# Altium schematic sheet MCP39F511A.SchDoc
size A3
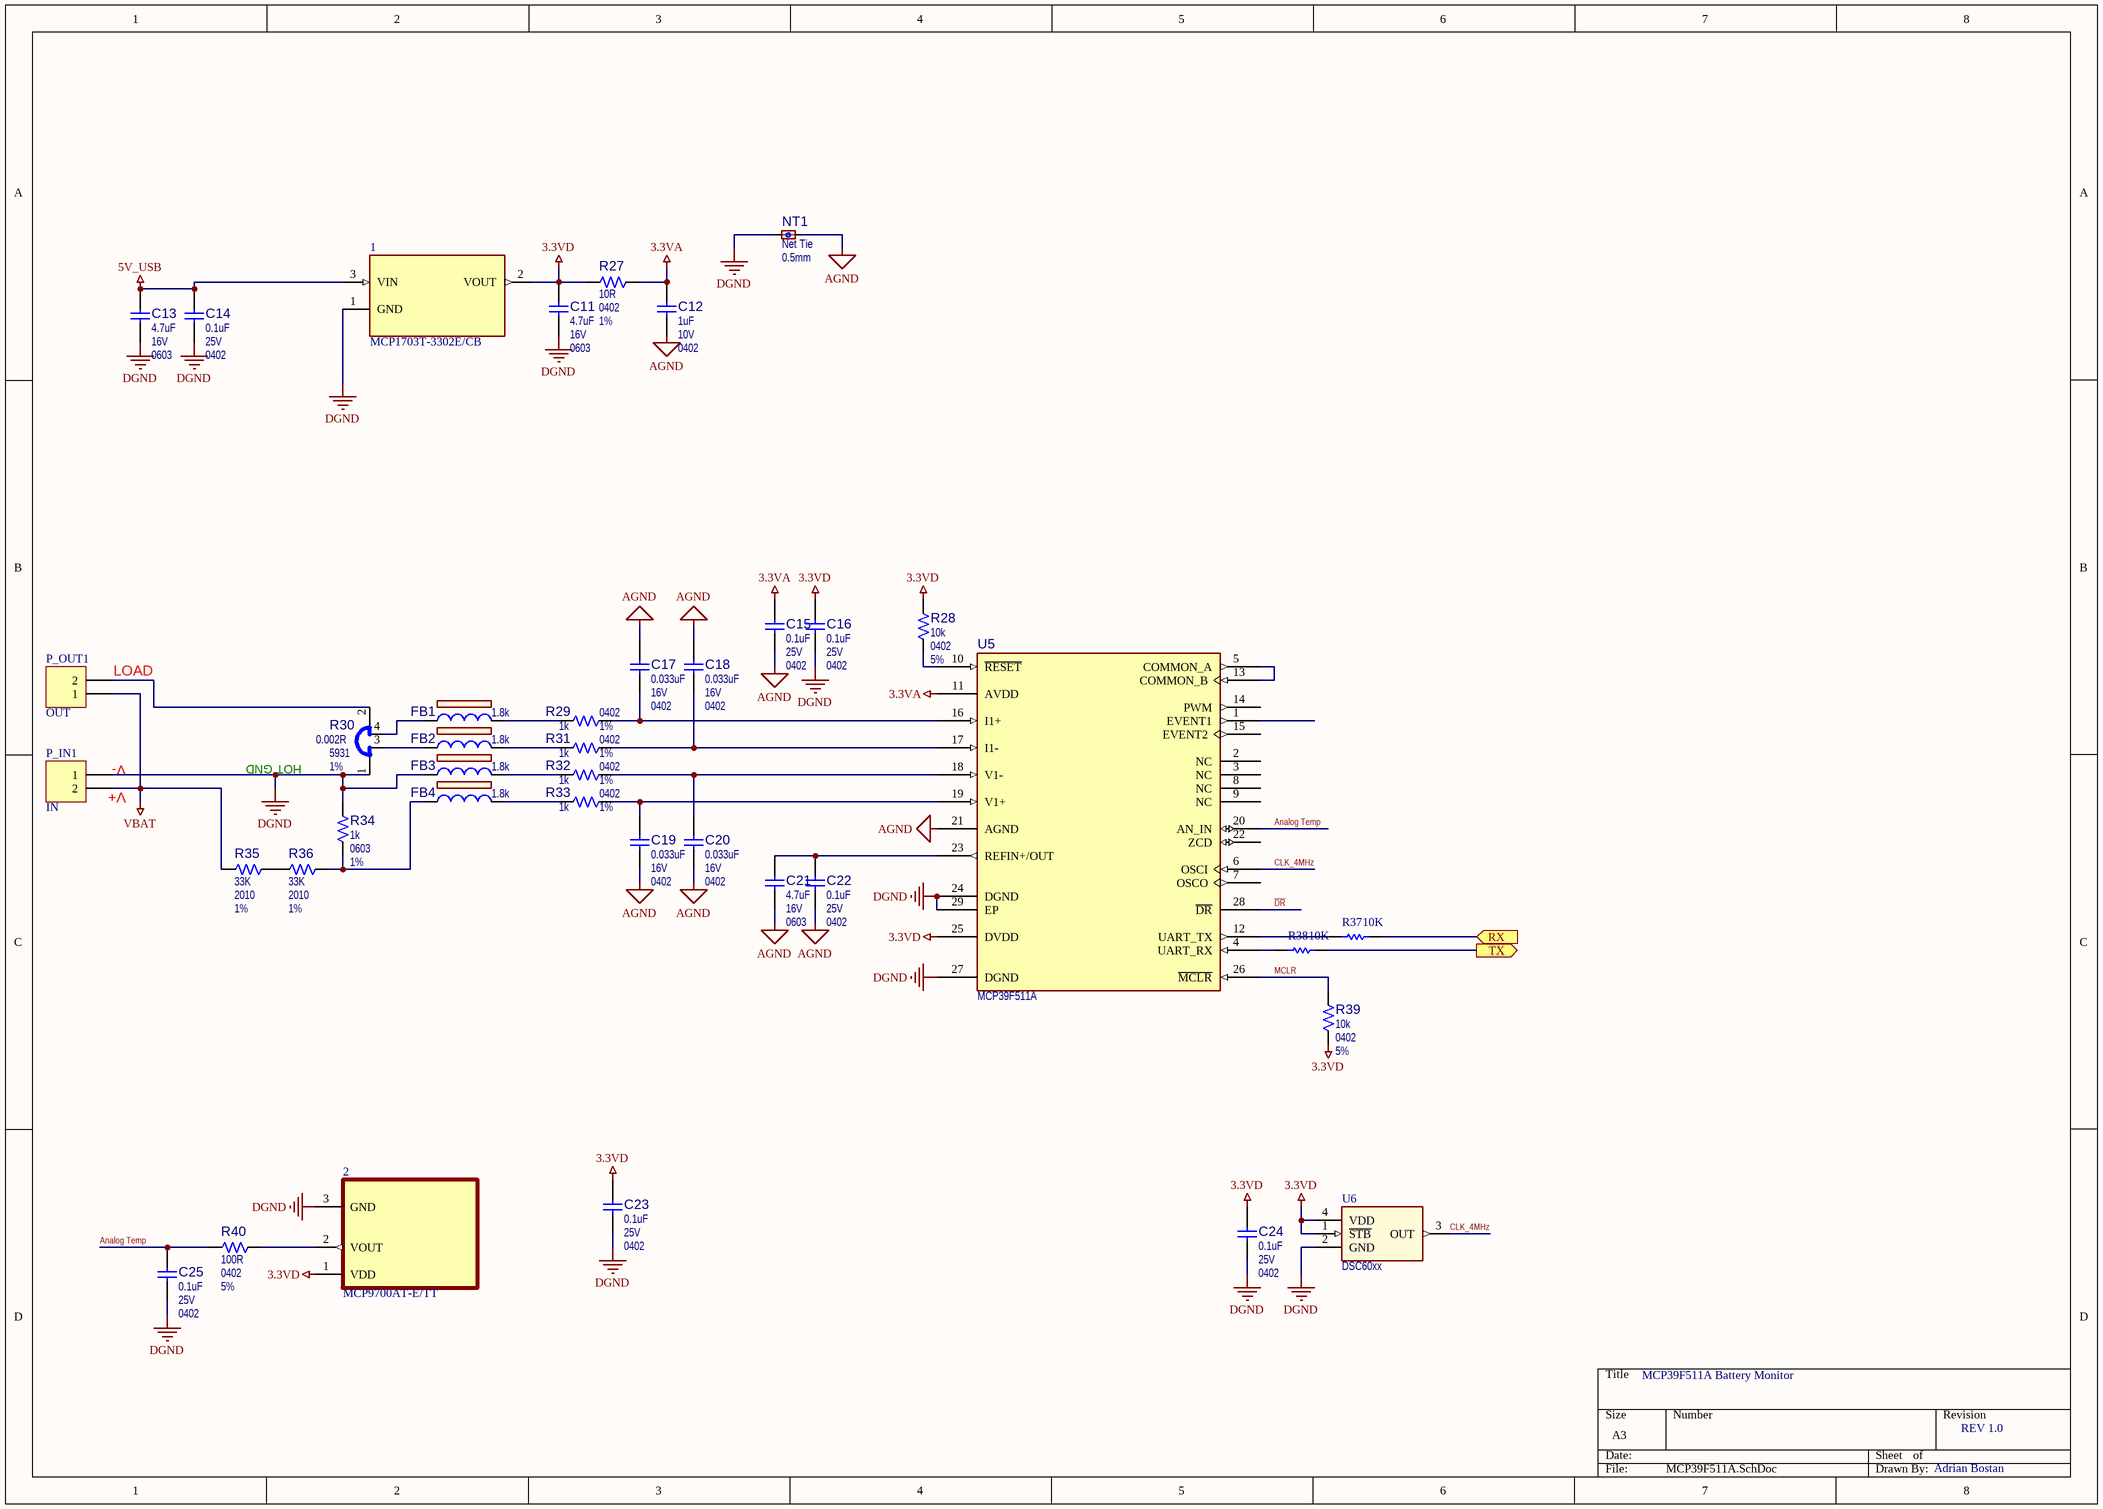
[diagram p0: MCP39F511A.SchDoc]

## Parts
1  MCP1703T-3302E/CB  [SOT95P300X145-3N]
2  MCP9700AT-E/TT  [SOT95P237X112-3N]
C11  value 4.7uF  Voltage: 16V  Package: 0603  [CAP0603M]
C12  value 1uF  Voltage: 10V  Package: 0402  [CAP0603M]
C13  value 4.7uF  Voltage: 16V  Package: 0603  [CAP0603M]
C14  value 0.1uF  Voltage: 25V  Package: 0402  [CAP0603M]
C15  value 0.1uF  Voltage: 25V  Package: 0402  [CAP0603M]
C16  value 0.1uF  Voltage: 25V  Package: 0402  [CAP0603M]
C17  value 0.033uF  Voltage: 16V  Package: 0402  [CAP0603M]
C18  value 0.033uF  Voltage: 16V  Package: 0402  [CAP0603M]
C19  value 0.033uF  Voltage: 16V  Package: 0402  [CAP0603M]
C20  value 0.033uF  Voltage: 16V  Package: 0402  [CAP0603M]
C21  value 4.7uF  Voltage: 16V  Package: 0603  [CAP0603M]
C22  value 0.1uF  Voltage: 25V  Package: 0402  [CAP0603M]
C23  value 0.1uF  Voltage: 25V  Package: 0402  [CAP0603M]
C24  value 0.1uF  Voltage: 25V  Package: 0402  [CAP0603M]
C25  value 0.1uF  Voltage: 25V  Package: 0402  [CAP0603M]
FB1  value 1.8k  [RES0603M]
FB2  value 1.8k  [RES0603M]
FB3  value 1.8k  [RES0603M]
FB4  value 1.8k  [RES0603M]
NT1  Package: 0.5mm  [NET_TIE_0.5mm]  (hidden comment: Net Tie)  (net tie, no BOM)
P_IN1  IN  [XT60PW-M]
P_OUT1  OUT  [XT60PW-F]
R27  value 10R  Package: 0402  Tolerance: 1%  [RES0603M]
R28  value 10k  Package: 0402  Tolerance: 5%  [RES0603M]  (hidden comment: Resistor)
R29  value 1k  Package: 0402  Tolerance: 1%  [RES0603M]  (hidden comment: Resistor)
R30  value 0.002R  Tolerance: 1%  [5931]  (hidden comment: Shunt 4 Pin)
R31  value 1k  Package: 0402  Tolerance: 1%  [RES0603M]  (hidden comment: Resistor)
R32  value 1k  Package: 0402  Tolerance: 1%  [RES0603M]  (hidden comment: Resistor)
R33  value 1k  Package: 0402  Tolerance: 1%  [RES0603M]  (hidden comment: Resistor)
R34  value 1k  Package: 0603  Tolerance: 1%  [RES0603M]  (hidden comment: Resistor)
R35  value 33K  Package: 2010  Tolerance: 1%  [RES2010]  (hidden comment: Resistor)
R36  value 33K  Package: 2010  Tolerance: 1%  [RES2010]  (hidden comment: Resistor)
R37  value 10K  [RES0603M]  (hidden comment: Res1)
R38  value 10K  [RES0603M]  (hidden comment: Res1)
R39  value 10k  Package: 0402  Tolerance: 5%  [RES0603M]  (hidden comment: Resistor)
R40  value 100R  Package: 0402  Tolerance: 5%  [RES0603M]  (hidden comment: Resistor)
U5  value MCP39F511A  [QFN50P500X500X100-29N]  (hidden comment: MCP39F511 QFN-28)
U6  value DSC60xx  [DSC60xx]  (hidden comment: OSCILLATOR DSC1001)

## Ports
RX (in), TX (out)

## Nets
3.3VA: C12.2 C15.2 R27.2 U5.11(AVDD)
3.3VD: 1.2(VOUT) 2.1(VDD) C11.2 C16.2 C23.2 C24.2 R27.1 R28.2 R39.1 U5.25(DVDD) U6.1(~{STB}) U6.4(VDD)
5V_USB: 1.3(VIN) C13.1 C14.2
AGND: C12.1 C15.1 C17.2 C18.2 C19.1 C20.1 C21.1 C22.1 NT1.2 U5.21(AGND)
DGND: 1.1(GND) 2.3(GND) C11.1 C13.2 C14.1 C16.1 C23.1 C24.1 C25.1 FB3.1 NT1.1 P_IN1.1 R30.1 R34.2 U5.24(DGND) U5.27(DGND) U5.29(EP) U6.2(GND)
VBAT: P_IN1.2 P_OUT1.1 R35.1
Analog Temp: C25.2 R40.1 U5.20(AN_IN)
CLK_4MHz: U5.6(OSCI) U6.3(OUT)
~{DR}: U5.28(~{DR})
MCLR: R39.2 U5.26(~{MCLR})
RX: R37.1 ; port RX
TX: R38.1 ; port TX
Net2_2: 2.2(VOUT) R40.2
NetC17_1: C17.1 R29.2 U5.16(I1+)
NetC18_1: C18.1 R31.2 U5.17(I1-)
NetC19_2: C19.2 R33.2 U5.19(V1+)
NetC20_2: C20.2 R32.2 U5.18(V1-)
NetC21_2: C21.2 C22.2 U5.23(REFIN+/OUT)
NetFB1_1: FB1.1 R30.4
NetFB1_2: FB1.2 R29.1
NetFB2_1: FB2.1 R30.3
NetFB2_2: FB2.2 R31.1
NetFB3_2: FB3.2 R32.1
NetFB4_1: FB4.1 R34.1 R36.1
NetFB4_2: FB4.2 R33.1
NetP_OUT1_2: P_OUT1.2 R30.2
NetR28_1: R28.1 U5.10(~{RESET})
NetR35_2: R35.2 R36.2
NetR37_2: R37.2 U5.12(UART_TX)
NetR38_2: R38.2 U5.4(UART_RX)
NetU5_5: U5.5(COMMON_A) U5.13(COMMON_B)

Not connected (* = marked no-connect by the designer): U5 1(EVENT1) 2(NC) 3(NC) 7(OSCO) 8(NC) 9(NC) 14(PWM) 15(EVENT2) 22(ZCD)

## Notes on the sheet
- (near P_OUT1) LOAD
- (near P_IN1) V+
- (near P_IN1) V-
- HOT GND
- MCP39F511A Battery Monitor
- REV 1.0
- Adrian Bostan

## Library data of the parts
1 = MCP1703T-3302E/CB: Linear Voltage Regulator IC 1 Output 250mA SOT-23A-3; MF: Microchip; Price: None; Availability: Unavailable; MP: MCP1703T-3302E/CB; Package: SOT-23 Microchip; SnapEDA_Link: https://www.snapeda.com/parts/MCP1703T-3302E/CB/Microchip/view-part/47542/?ref=snap; Value: *
2 = MCP9700AT-E/TT: Temperature Sensor Analog, Local -40Â°C ~ 125Â°C 10mV/Â°C SOT-23-3; MF: Microchip; Package: SOT-23-3 Microchip; MP: MCP9700AT-E/TT; Value: *; Availability: Unavailable; Price: None; SnapEDA_Link: https://www.snapeda.com/parts/MCP9700AT-E/TT/Microchip/view-part/105359/?ref=snap
C11 C21 = CAP1288: Capacitor; Manufacturer 1: TDK Corporation; Manufacturer Part Number 1: C1608X5R1C475K080AC; Description_: CAP CER 4.7uF 16V 10% X5R SMD 0603; Dev Tools Status: Production; Tolerance: 10%; Temperature Coeffcient: X5R; Type: Ceramic; Owner: Jairuz Agang-ang; Populated: YES; MCHP-ID: CAP1288; Revision: 1; Symbol: Capacitor NP; Status: MCL Design; ComponentLink1URL: https://chn-vm-apps.microchip.com/mchprepo/parts/Datasheets/mlcc_commercial_general_en.pdf; ComponentLink1Description: SVN Datasheet; ComponentLink2URL: C:\ALTIUM_WORK\00001_MCHP-CDB\Datasheets\mlcc_commercial_general_en.pdf; ComponentLink2Description: Local Datasheet; ComponentLink3URL: C:\ALTIUM_WORK\00001_MCHP-CDB\Library\LibraryRefs\Capacitor NP.SchLib; ComponentLink3Description: Open Symbol; ComponentLink4URL: C:\ALTIUM_WORK\00001_MCHP-CDB\Library\Footprints\CAP_C_0603.PcbLib; ComponentLink4Description: Open Footprint; ComponentLink5Description: Open Footprint 2; ComponentLink6Description: Open Footprint 3; ComponentLink7Description: Open Footprint 4; Operating Temperature: -55C to +85C; Category: Capacitor; Supplier 1: Digi-Key; Supplier Part Number 1: 445-7478-1-ND; Quantity Override: 1
C12 = CAP1183: Capacitor; Manufacturer 1: Murata Electronics North America; Manufacturer Part Number 1: GRM155R61A105KE15D; Description_: CAP CER 1uF 10V 10% X5R SMD 0402; Dev Tools Status: Production; Tolerance: 10%; Temperature Coeffcient: X5R; Type: Ceramic; Owner: Aaron VanDuerm; Populated: YES; MCHP-ID: CAP1183; Revision: 0; Symbol: Capacitor NP; Status: MCL Design; ComponentLink1URL: https://chn-vm-apps.microchip.com/mchprepo/parts/Datasheets/CL05A105KP5NNNC1.pdf; ComponentLink1Description: SVN Datasheet; ComponentLink2URL: C:\ALTIUM_WORK\00001_MCHP-CDB\Datasheets\CL05A105KP5NNNC1.pdf; ComponentLink2Description: Local Datasheet; ComponentLink3URL: C:\ALTIUM_WORK\00001_MCHP-CDB\Library\LibraryRefs\Capacitor NP.SchLib; ComponentLink3Description: Open Symbol; ComponentLink4URL: C:\ALTIUM_WORK\00001_MCHP-CDB\Library\Footprints\CAP_C_0402.PcbLib; ComponentLink4Description: Open Footprint; ComponentLink5Description: Open Footprint 2; ComponentLink6Description: Open Footprint 3; ComponentLink7Description: Open Footprint 4; Operating Temperature: -55C to +85C; Category: Capacitor; Supplier 1: Digi-Key; Supplier Part Number 1: 490-3890-1-ND; Quantity Override: 1; Manufacturer 2: Samsung; Manufacturer Part Number 2: CL05A105KP5NNNC; Supplier 2: Digi-Key; Supplier Part Number 2: 1276-1076-2-ND
C13 = CAP1288: Capacitor; Manufacturer 1: TDK Corporation; Manufacturer Part Number 1: C1608X5R1C475K080AC; Description_: CAP CER 4.7uF 16V 10% X5R SMD 0603; Dev Tools Status: Production; Tolerance: 10%; Temperature Coeffcient: X5R; Type: Ceramic; Populated: YES; Owner: Jairuz Agang-ang; MCHP-ID: CAP1288; Revision: 1; Symbol: Capacitor NP; Status: MCL Design; ComponentLink1URL: https://chn-vm-apps.microchip.com/mchprepo/parts/Datasheets/mlcc_commercial_general_en.pdf; ComponentLink1Description: SVN Datasheet; ComponentLink2URL: C:\ALTIUM_WORK\00001_MCHP-CDB\Datasheets\mlcc_commercial_general_en.pdf; ComponentLink2Description: Local Datasheet; ComponentLink3URL: C:\ALTIUM_WORK\00001_MCHP-CDB\Library\LibraryRefs\Capacitor NP.SchLib; ComponentLink3Description: Open Symbol; ComponentLink4URL: C:\ALTIUM_WORK\00001_MCHP-CDB\Library\Footprints\CAP_C_0603.PcbLib; ComponentLink4Description: Open Footprint; ComponentLink5Description: Open Footprint 2; ComponentLink6Description: Open Footprint 3; ComponentLink7Description: Open Footprint 4; Operating Temperature: -55C to +85C; Category: Capacitor; Supplier 1: Digi-Key; Supplier Part Number 1: 445-7478-1-ND; Quantity Override: 1
C14-C16 C22-C25 = CAP1345: Capacitor; Manufacturer 1: TDK Corporation; Manufacturer Part Number 1: C1005X7R1E104K050BB; Description_: CAP CER 0.1uF 25V 10% X7R SMD 0402; Dev Tools Status: Production; Tolerance: 10%; Temperature Coeffcient: X7R; Type: Ceramic; Owner: Randolph Sobrepena; Populated: YES; MCHP-ID: CAP1345; Revision: 1; Symbol: Capacitor NP; Status: MCL Design; ComponentLink1URL: https://chn-vm-apps.microchip.com/mchprepo/parts/Datasheets/mlcc_commercial_general_en; ComponentLink1Description: SVN Datasheet; ComponentLink2URL: C:\ALTIUM_WORK\00001_MCHP-CDB\Datasheets\mlcc_commercial_general_en; ComponentLink2Description: Local Datasheet; ComponentLink3URL: C:\ALTIUM_WORK\00001_MCHP-CDB\Library\LibraryRefs\Capacitor NP.SchLib; ComponentLink3Description: Open Symbol; ComponentLink4URL: C:\ALTIUM_WORK\00001_MCHP-CDB\Library\Footprints\CAP_C_0402.PcbLib; ComponentLink4Description: Open Footprint; ComponentLink5Description: Open Footprint 2; ComponentLink6Description: Open Footprint 3; ComponentLink7Description: Open Footprint 4; Operating Temperature: -55°C to 125°C; Category: Capacitor; Supplier 1: Digi-Key; Supplier Part Number 1: 445-7348-1-ND; Quantity Override: 1
C17-C20 = CAP1257: Capacitor; Manufacturer 1: TDK Corporation; Manufacturer Part Number 1: CGA2B2X7R1C333K050BA; Description_: CAP CER 0.033uF 16V 10% X7R SMD 0402; Dev Tools Status: Design; Tolerance: 10%; Temperature Coeffcient: X7R; Type: Ceramic; Owner: Bogdan Popescu; Populated: YES; MCHP-ID: CAP1257; Revision: A; Symbol: Capacitor NP; Status: MCL Design; ComponentLink1URL: https://chn-vm-apps.microchip.com/mchprepo/parts/Datasheets/mlcc_automotive_general_en.pdf; ComponentLink1Description: SVN Datasheet; ComponentLink2URL: C:\ALTIUM_WORK\00001_MCHP-CDB\Datasheets\mlcc_automotive_general_en.pdf; ComponentLink2Description: Local Datasheet; ComponentLink3URL: C:\ALTIUM_WORK\00001_MCHP-CDB\Library\LibraryRefs\Capacitor NP.SchLib; ComponentLink3Description: Open Symbol; ComponentLink4URL: C:\ALTIUM_WORK\00001_MCHP-CDB\Library\Footprints\CAP_C_0402.PcbLib; ComponentLink4Description: Open Footprint; ComponentLink5Description: Open Footprint 2; ComponentLink6Description: Open Footprint 3; ComponentLink7Description: Open Footprint 4; Operating Temperature: -55C to +125C; Category: Capacitor; Supplier 1: Digi-Key; Supplier Part Number 1: 445-12238-1-ND; Quantity Override: 1
FB1-FB4 = IND1351: Manufacturer 1: Murata Electronics; Manufacturer Part Number 1: BLM15HD182SN1D; Description_: FERRITE 1.8k 200mA SMD 0402; Dev Tools Status: Design; Owner: Razvan Cristescu; Populated: YES; DCR: 2.2R; Saturation Current: 200mA; Test Frequency: 100MHz; MCHP-ID: IND1351; Revision: A; Symbol: Ferrite Bead; Status: MCL Design; ComponentLink1URL: https://chn-vm-apps.microchip.com/mchprepo/parts/Datasheets/c31e-794748.pdf; ComponentLink1Description: SVN Datasheet; ComponentLink2URL: C:\ALTIUM_WORK\00001_MCHP-CDB\Datasheets\c31e-794748.pdf; ComponentLink2Description: Local Datasheet; ComponentLink3URL: C:\ALTIUM_WORK\00001_MCHP-CDB\Library\LibraryRefs\Ferrite Bead.SchLib; ComponentLink3Description: Open Symbol; ComponentLink4URL: C:\ALTIUM_WORK\00001_MCHP-CDB\Library\LibraryRefs\IND_C_0402.PcbLib; ComponentLink4Description: Open Footprint; ComponentLink5Description: Open Footprint 2; ComponentLink6Description: Open Footprint 3; ComponentLink7Description: Open Footprint 4; Type: Ferrite Bead; Category: Inductor; Supplier 1: Mouser; Supplier Part Number 1: 81-BLM15HD182SN1D; Quantity Override: 1; Operating Temperature: -55C to +125C; Package: 0402
NT1 = RES1102: Description_: RES Net Tie SMD Net Tie 0.5mm; Dev Tools Status: Production; Owner: Bogdan P (M91398); Populated: Yes; MCHP-ID: RES1102; Value: Net Tie; Revision: 0; Symbol: Net Tie; Status: MCL Design; ComponentLink1Description: SVN Datasheet; ComponentLink2Description: Local Datasheet; ComponentLink3URL: C:\ALTIUM_WORK\00001_MCHP-CDB\Library\LibraryRefs\Net Tie.SchLib; ComponentLink3Description: Open Symbol; ComponentLink4URL: C:\ALTIUM_WORK\00001_MCHP-CDB\Library\Footprints\NET_TIE_0.5mm.PcbLib; ComponentLink4Description: Open Footprint; ComponentLink5Description: Open Footprint 2; ComponentLink6Description: Open Footprint 3; ComponentLink7Description: Open Footprint 4; Category: Resistor; Type: RES SMD; Quantity Override: 1
P_IN1 P_OUT1 = Header 2: Header, 2-Pin; LatestRevisionDate: 17-Jul-2002; LatestRevisionNote: Re-released for DXP Platform.; Publisher: Altium Limited
R27 = RES1305: Resistor; Manufacturer 1: ROHM; Manufacturer Part Number 1: MCR01MRTF10R0; Description_: RES TKF 10R 1% 1/16W SMD 0402; Dev Tools Status: Production; Voltage: 50V; Temperature Coeffcient: 100ppm/C; Power: 1/16W; Owner: Tad Ahlvers; Populated: YES; MCHP-ID: RES1305; Revision: 1; Symbol: Resistor; Status: MCL Design; ComponentLink1URL: https://chn-vm-apps.microchip.com/mchprepo/parts/Datasheets/mcr_g.pdf; ComponentLink1Description: SVN Datasheet; ComponentLink2URL: C:\ALTIUM_WORK\00001_MCHP-CDB\Datasheets\mcr_g.pdf; ComponentLink2Description: Local Datasheet; ComponentLink3URL: C:\ALTIUM_WORK\00001_MCHP-CDB\Library\LibraryRefs\Resistor.SchLib; ComponentLink3Description: Open Symbol; ComponentLink4URL: C:\ALTIUM_WORK\00001_MCHP-CDB\Library\Footprints\RES_C_0402.PcbLib; ComponentLink4Description: Open Footprint; ComponentLink5Description: Open Footprint 2; ComponentLink6Description: Open Footprint 3; ComponentLink7Description: Open Footprint 4; Operating Temperature: -55C to +155C; Category: Resistor; Type: RES SMD; Composition: TKF; Supplier 1: Digi-Key; Supplier Part Number 1: RHM10.0CDTR-ND; Quantity Override: 1
R28 R39 = RSMT0439: Manufacturer 1: Vishay; Manufacturer Part Number 1: CRCW040210K0JNED; Description_: RES TKF 10k 5% 1/16W SMD 0402; Dev Tools Status: Production; Voltage: 50V; Temperature Coeffcient: 100ppm/C; Power: 1/16W; Populated: Yes; MCHP-ID: RSMT0439; Revision: 1; Symbol: Resistor; Status: MCL Design; ComponentLink1URL: https://chn-vm-apps.microchip.com/mchprepo/parts/Datasheets/PYu-RC0402_51_RoHS_L_6.pdf; ComponentLink1Description: SVN Datasheet; ComponentLink2URL: C:\ALTIUM_WORK\00001_MCHP-CDB\Datasheets\PYu-RC0402_51_RoHS_L_6.pdf; ComponentLink2Description: Local Datasheet; ComponentLink3URL: C:\ALTIUM_WORK\00001_MCHP-CDB\Library\LibraryRefs\Resistor.SchLib; ComponentLink3Description: Open Symbol; ComponentLink4URL: C:\ALTIUM_WORK\00001_MCHP-CDB\Library\Footprints\RES_C_0402.PcbLib; ComponentLink4Description: Open Footprint; ComponentLink5Description: Open Footprint 2; ComponentLink6Description: Open Footprint 3; ComponentLink7Description: Open Footprint 4; Operating Temperature: -55C to +155C; Category: Resistor; Type: RES SMD; Composition: TKF; Manufacturer 2: Yageo; Manufacturer Part Number 2: RC0402JR-0710KL; Supplier 1: Digi-Key; Supplier Part Number 1: 541-10KJCT-ND; Supplier 2: Digi-Key; Supplier Part Number 2: 311-10KJRCT-ND; Quantity Override: 1
R29 R31-R33 = RES1022: Manufacturer 1: Panasonic; Manufacturer Part Number 1: ERJ-2RKF1001X; Description_: RES TKF 1k 1% 1/10W SMD 0402; Dev Tools Status: Production; Voltage: 50V; Temperature Coeffcient: 100ppm/C; Power: 1/10W; Owner: Tad Ahlvers; Populated: YES; MCHP-ID: RES1022; Revision: 2; Symbol: Resistor; Status: MCL Design; ComponentLink1URL: https://chn-vm-apps.microchip.com/mchprepo/parts/Datasheets/AOA0000CE2.pdf; ComponentLink1Description: SVN Datasheet; ComponentLink2URL: C:\ALTIUM_WORK\00001_MCHP-CDB\Datasheets\AOA0000CE2.pdf; ComponentLink2Description: Local Datasheet; ComponentLink3URL: C:\ALTIUM_WORK\00001_MCHP-CDB\Library\LibraryRefs\Resistor.SchLib; ComponentLink3Description: Open Symbol; ComponentLink4URL: C:\ALTIUM_WORK\00001_MCHP-CDB\Library\Footprints\RES_C_0402.PcbLib; ComponentLink4Description: Open Footprint; ComponentLink5Description: Open Footprint 2; ComponentLink6Description: Open Footprint 3; ComponentLink7Description: Open Footprint 4; Operating Temperature: -55C to +155C; Category: Resistor; Type: RES SMD; Composition: TKF; Supplier 1: Digi-Key; Supplier Part Number 1: P1.00KLTR-ND; Quantity Override: 1
R30 = RES1247: Shunt; Manufacturer 1: Stackpole Electronics Inc; Manufacturer Part Number 1: CSNL2512FT2L00; Description_: RES SHUNT MF 0.002R 1% 2W 2512; Dev Tools Status: Production; Voltage: 200V; Temperature Coeffcient: 50ppm/C; Power: 2W; Owner: Bogdan P (M91398); Populated: Yes; MCHP-ID: RES1247; Package: 5931; Revision: 0; Symbol: Shunt 4 Pin; Status: MCL Design; ComponentLink1URL: https://chn-vm-apps.microchip.com/mchprepo/parts/Datasheets/SEI-CSNL.pdf; ComponentLink1Description: SVN Datasheet; ComponentLink2URL: C:\ALTIUM_WORK\00001_MCHP-CDB\Datasheets\SEI-CSNL.pdf; ComponentLink2Description: Local Datasheet; ComponentLink3URL: C:\ALTIUM_WORK\00001_MCHP-CDB\Library\LibraryRefs\Shunt 4 Pin.SchLib; ComponentLink3Description: Open Symbol; ComponentLink4URL: C:\ALTIUM_WORK\00001_MCHP-CDB\Library\Footprints\RES_C_2512_SHUNT.PcbLib; ComponentLink4Description: Open Footprint; ComponentLink5Description: Open Footprint 2; ComponentLink6Description: Open Footprint 3; ComponentLink7Description: Open Footprint 4; Operating Temperature: -55C to +170C; Category: Resistor; Type: Shunt; Composition: MF; Supplier 1: Digi-Key; Supplier Part Number 1: LRMAP5930C-R002FT; Quantity Override: 1
R34 = RSMT0138: Manufacturer 1: Panasonic; Manufacturer Part Number 1: ERJ-3EKF1001V; Description_: RES TKF 1k 1% 1/10W SMD 0603; Dev Tools Status: Production; Voltage: 75V; Temperature Coeffcient: 100ppm/C; Power: 1/10W; Populated: Yes; MCHP-ID: RSMT0138; Revision: 2; Symbol: Resistor; Status: MCL Design; ComponentLink1URL: https://chn-vm-apps.microchip.com/mchprepo/parts/Datasheets/AOA0000CE2.pdf; ComponentLink1Description: SVN Datasheet; ComponentLink2URL: C:\ALTIUM_WORK\00001_MCHP-CDB\Datasheets\AOA0000CE2.pdf; ComponentLink2Description: Local Datasheet; ComponentLink3URL: C:\ALTIUM_WORK\00001_MCHP-CDB\Library\LibraryRefs\Resistor.SchLib; ComponentLink3Description: Open Symbol; ComponentLink4URL: C:\ALTIUM_WORK\00001_MCHP-CDB\Library\Footprints\RES_C_0603.PcbLib; ComponentLink4Description: Open Footprint; ComponentLink5Description: Open Footprint 2; ComponentLink6Description: Open Footprint 3; ComponentLink7Description: Open Footprint 4; Operating Temperature: -55C to +155C; Category: Resistor; Type: RES SMD; Composition: TKF; Manufacturer 2: Yageo; Manufacturer Part Number 2: RC0603FR-071KL; Manufacturer 3: ROHM; Manufacturer Part Number 3: MCR03EZPFX1001; Manufacturer 4: Stackpole Electronics Inc; Manufacturer Part Number 4: RMCF0603FT1K00; Manufacturer 5: Stackpole Electronics Inc; Manufacturer Part Number 5: RMCF 1/16 1K 1% R; Manufacturer 6: Vishay; Manufacturer Part Number 6: CRCW06031K00FKEA; Manufacturer 7: Stackpole Electronics Inc; Manufacturer Part Number 7: RMCF1/161.0K1%TR; Manufacturer 8: TE Connectivity; Manufacturer Part Number 8: 1622866-1; Supplier 1: Digi-Key; Supplier Part Number 1: P1.00KHCT-ND; Supplier 2: Digi-Key; Supplier Part Number 2: P1.00KHTR-ND; Supplier 3: Digi-Key; Supplier Part Number 3: 311-1.00KHRCT-ND; Supplier 4: Digi-Key; Supplier Part Number 4: RHM1.00KHCT-ND; Supplier 5: Digi-Key; Supplier Part Number 5: RMCF1/161KFRTR-ND; Supplier 6: Digi-Key; Supplier Part Number 6: RMCF0603FT1K00TR-ND; Supplier 7: Newark; Supplier Part Number 7: 52K8015; Supplier 8: Stackpole Electronics Inc; Supplier Part Number 8: RMCF1/161.0K1%TR; Supplier 9: Digi-Key; Supplier Part Number 9: A106049CT-ND; Quantity Override: 1
R35 R36 = RSMT1084: Manufacturer 1: Vishay Dale; Manufacturer Part Number 1: CRCW2010499KFKEF; Description_: RES TKF 499k 1% 3/4W SMD 2010; Dev Tools Status: Production; Voltage: 400V; Temperature Coeffcient: 100ppm/C; Power: 3/4W; Owner: Bogdan Popescu; Populated: YES; MCHP-ID: RSMT1084; Revision: 1; Symbol: Resistor; Status: MCL Design; ComponentLink1URL: https://chn-vm-apps.microchip.com/mchprepo/parts/Datasheets/dcrcwe3.pdf; ComponentLink1Description: SVN Datasheet; ComponentLink2URL: C:\ALTIUM_WORK\00001_MCHP-CDB\Datasheets\dcrcwe3.pdf; ComponentLink2Description: Local Datasheet; ComponentLink3URL: C:\ALTIUM_WORK\00001_MCHP-CDB\Library\LibraryRefs\Resistor.SchLib; ComponentLink3Description: Open Symbol; ComponentLink4URL: C:\ALTIUM_WORK\00001_MCHP-CDB\Library\Footprints\RES_C_2010.PcbLib; ComponentLink4Description: Open Footprint; ComponentLink5Description: Open Footprint 2; ComponentLink6Description: Open Footprint 3; ComponentLink7Description: Open Footprint 4; Category: Resistor; Type: RES SMD; Composition: TKF; Supplier 1: Digi-Key; Supplier Part Number 1: 541-499KACCT-ND; Quantity Override: 1
R37 R38 = Res1: Resistor; Published: 8-Jun-2000; LatestRevisionDate: 17-Jul-2002; LatestRevisionNote: Re-released for DXP Platform.; PackageReference: AXIAL-0.3; Publisher: Altium Limited; PackageDescription: Axial Device, Thru-Hole; 2 Leads; 0.3 in Pin Spacing
R40 = RSMT1038: Manufacturer 1: Yageo; Manufacturer Part Number 1: RC0402JR-07100RL; Description_: RES TKF 100R 5% 1/16W SMD 0402; Dev Tools Status: Production; Voltage: 50V; Temperature Coeffcient: 100ppm/C; Power: 1/16W; Owner: Sompoch Loboonlert; Populated: Yes; MCHP-ID: RSMT1038; Revision: 2; Symbol: Resistor; Status: MCL Design; ComponentLink1URL: https://chn-vm-apps.microchip.com/mchprepo/parts/Datasheets/PYu-RC0402_51_RoHS_L_6.pdf; ComponentLink1Description: SVN Datasheet; ComponentLink2URL: C:\ALTIUM_WORK\00001_MCHP-CDB\Datasheets\PYu-RC0402_51_RoHS_L_6.pdf; ComponentLink2Description: Local Datasheet; ComponentLink3URL: C:\ALTIUM_WORK\00001_MCHP-CDB\Library\LibraryRefs\Resistor.SchLib; ComponentLink3Description: Open Symbol; ComponentLink4URL: C:\ALTIUM_WORK\00001_MCHP-CDB\Library\Footprints\RES_C_0402.PcbLib; ComponentLink4Description: Open Footprint; ComponentLink5Description: Open Footprint 2; ComponentLink6Description: Open Footprint 3; ComponentLink7Description: Open Footprint 4; Operating Temperature: -55C to +155C; Category: Resistor; Type: RES SMD; Composition: TKF; Supplier 1: Digi-Key; Supplier Part Number 1: 311-100JRCT-ND; Quantity Override: 1
U5 = MIC6226: ADC; Manufacturer 1: Microchip Technology; Manufacturer Part Number 1: MCP39F511-E/MQ; Description_: MCHP ANALOG ENERGY MEASUREMENT 4000:1 MCP39F511-E/MQ QFN-28; MAPS Description: Single-Phase, Power-Monitoring IC with Calculation and Event Detection; Dev Tools Status: Production; Owner: Bogdan Popescu; MPC: 360234P7X031; LeadContent: Pb-FREE; PackingMedia: TUBE; Stage: REL; LeadCount: 28; PackageWidth: 5x5x0.9mm; ForceMinOrderQtyMult: False; MinOrderQty: 0; TempRange: -40C to +125C; SeriInterface: UART; tblDeviceFamilyID: 5874; singleOR3phase: Single; ADCResBit: 24; ADCAccuracy: 94.5; AntiTemper: No; PhaseCorrctn: Yes; noOfPGAs: 2; PGARange: 1:32; MeasurementErr: 0.1%; DynamicRange: 4000:1; VoltageRefDrift: 10; SupplyVoltMin: 2.7; SupplyVoltMax: 3.6; MCHP-ID: MIC6226; Symbol: MCP39F511 QFN-28; Type: Energy Measurement; Status: MCL Design; Revision: 1; Category: MCHP-Analog; ComponentLink1URL: http://www.microchip.com/wwwproducts/Devices.aspx?product=MCP39F511; ComponentLink1Description: SVN Datasheet; ComponentLink2Description: Local Datasheet; ComponentLink3URL: C:\ALTIUM_WORK\00001_MCHP-CDB\Library\LibraryRefs\MCP39F511 QFN-28.SchLib; ComponentLink3Description: Open Symbol; ComponentLink4URL: C:\ALTIUM_WORK\00001_MCHP-CDB\Library\Footprints\QFN-28_5x5.PcbLib; ComponentLink4Description: Open Footprint; ComponentLink5Description: Open Footprint 2; ComponentLink6Description: Open Footprint 3; ComponentLink7Description: Open Footprint 4; Supplier 1: Microchip Technology; Supplier Part Number 1: MCP39F511-E/MQ; IntroductionDate: 2015-03-19; PackageType: QFN; ActivePwrCalc: Yes; VoltageRefTol: 2; DigPwrVoltMin: 2.7; DigPwrVoltMax: 3.6; IDDDigMax: 0; IDDAnaMax: 0; Populated: YES; Quantity Override: 1
U6 = OSC1131: Manufacturer 1: Microchip Technology Inc; Manufacturer Part Number 1: DSC6011JI1A-008.0000; Description_: MEMS Oscillator DSC60XX 8MHz SMD L2W2.5H.89; Dev Tools Status: Design; Owner: Tim Moffat; Populated: YES; MCHP-ID: OSC1131; Revision: B; Symbol: OSCILLATOR DSC1001; Status: MCL Design; ComponentLink1URL: https://chn-vm-apps.microchip.com/mchprepo/parts/Datasheets/20005625A.pdf; ComponentLink1Description: SVN Datasheet; ComponentLink2URL: C:\ALTIUM_WORK\00001_MCHP-CDB\Datasheets\20005625A.pdf; ComponentLink2Description: Local Datasheet; ComponentLink3URL: C:\ALTIUM_WORK\00001_MCHP-CDB\Library\LibraryRefs\OSCILLATOR DSC1001.SchLib; ComponentLink3Description: Open Symbol; ComponentLink4URL: C:\ALTIUM_WORK\00001_MCHP-CDB\Library\Footprints\OSCILLATOR_DSC60000L2.5W2.0H0.89.PcbLib; ComponentLink4Description: Open Footprint; ComponentLink5Description: Open Footprint 2; ComponentLink6Description: Open Footprint 3; ComponentLink7Description: Open Footprint 4; Operating Temperature: –40C to +85C; Package: LGA; Type: Oscillator; Category: Crystal/Oscillator; Supplier 1: Microchip Technology Inc; Supplier Part Number 1: DSC6011JI1A-008.0000; Quantity Override: 1